# EAGLE board AtariST microATX (EAGLE 7.7.0), part 1 of 3
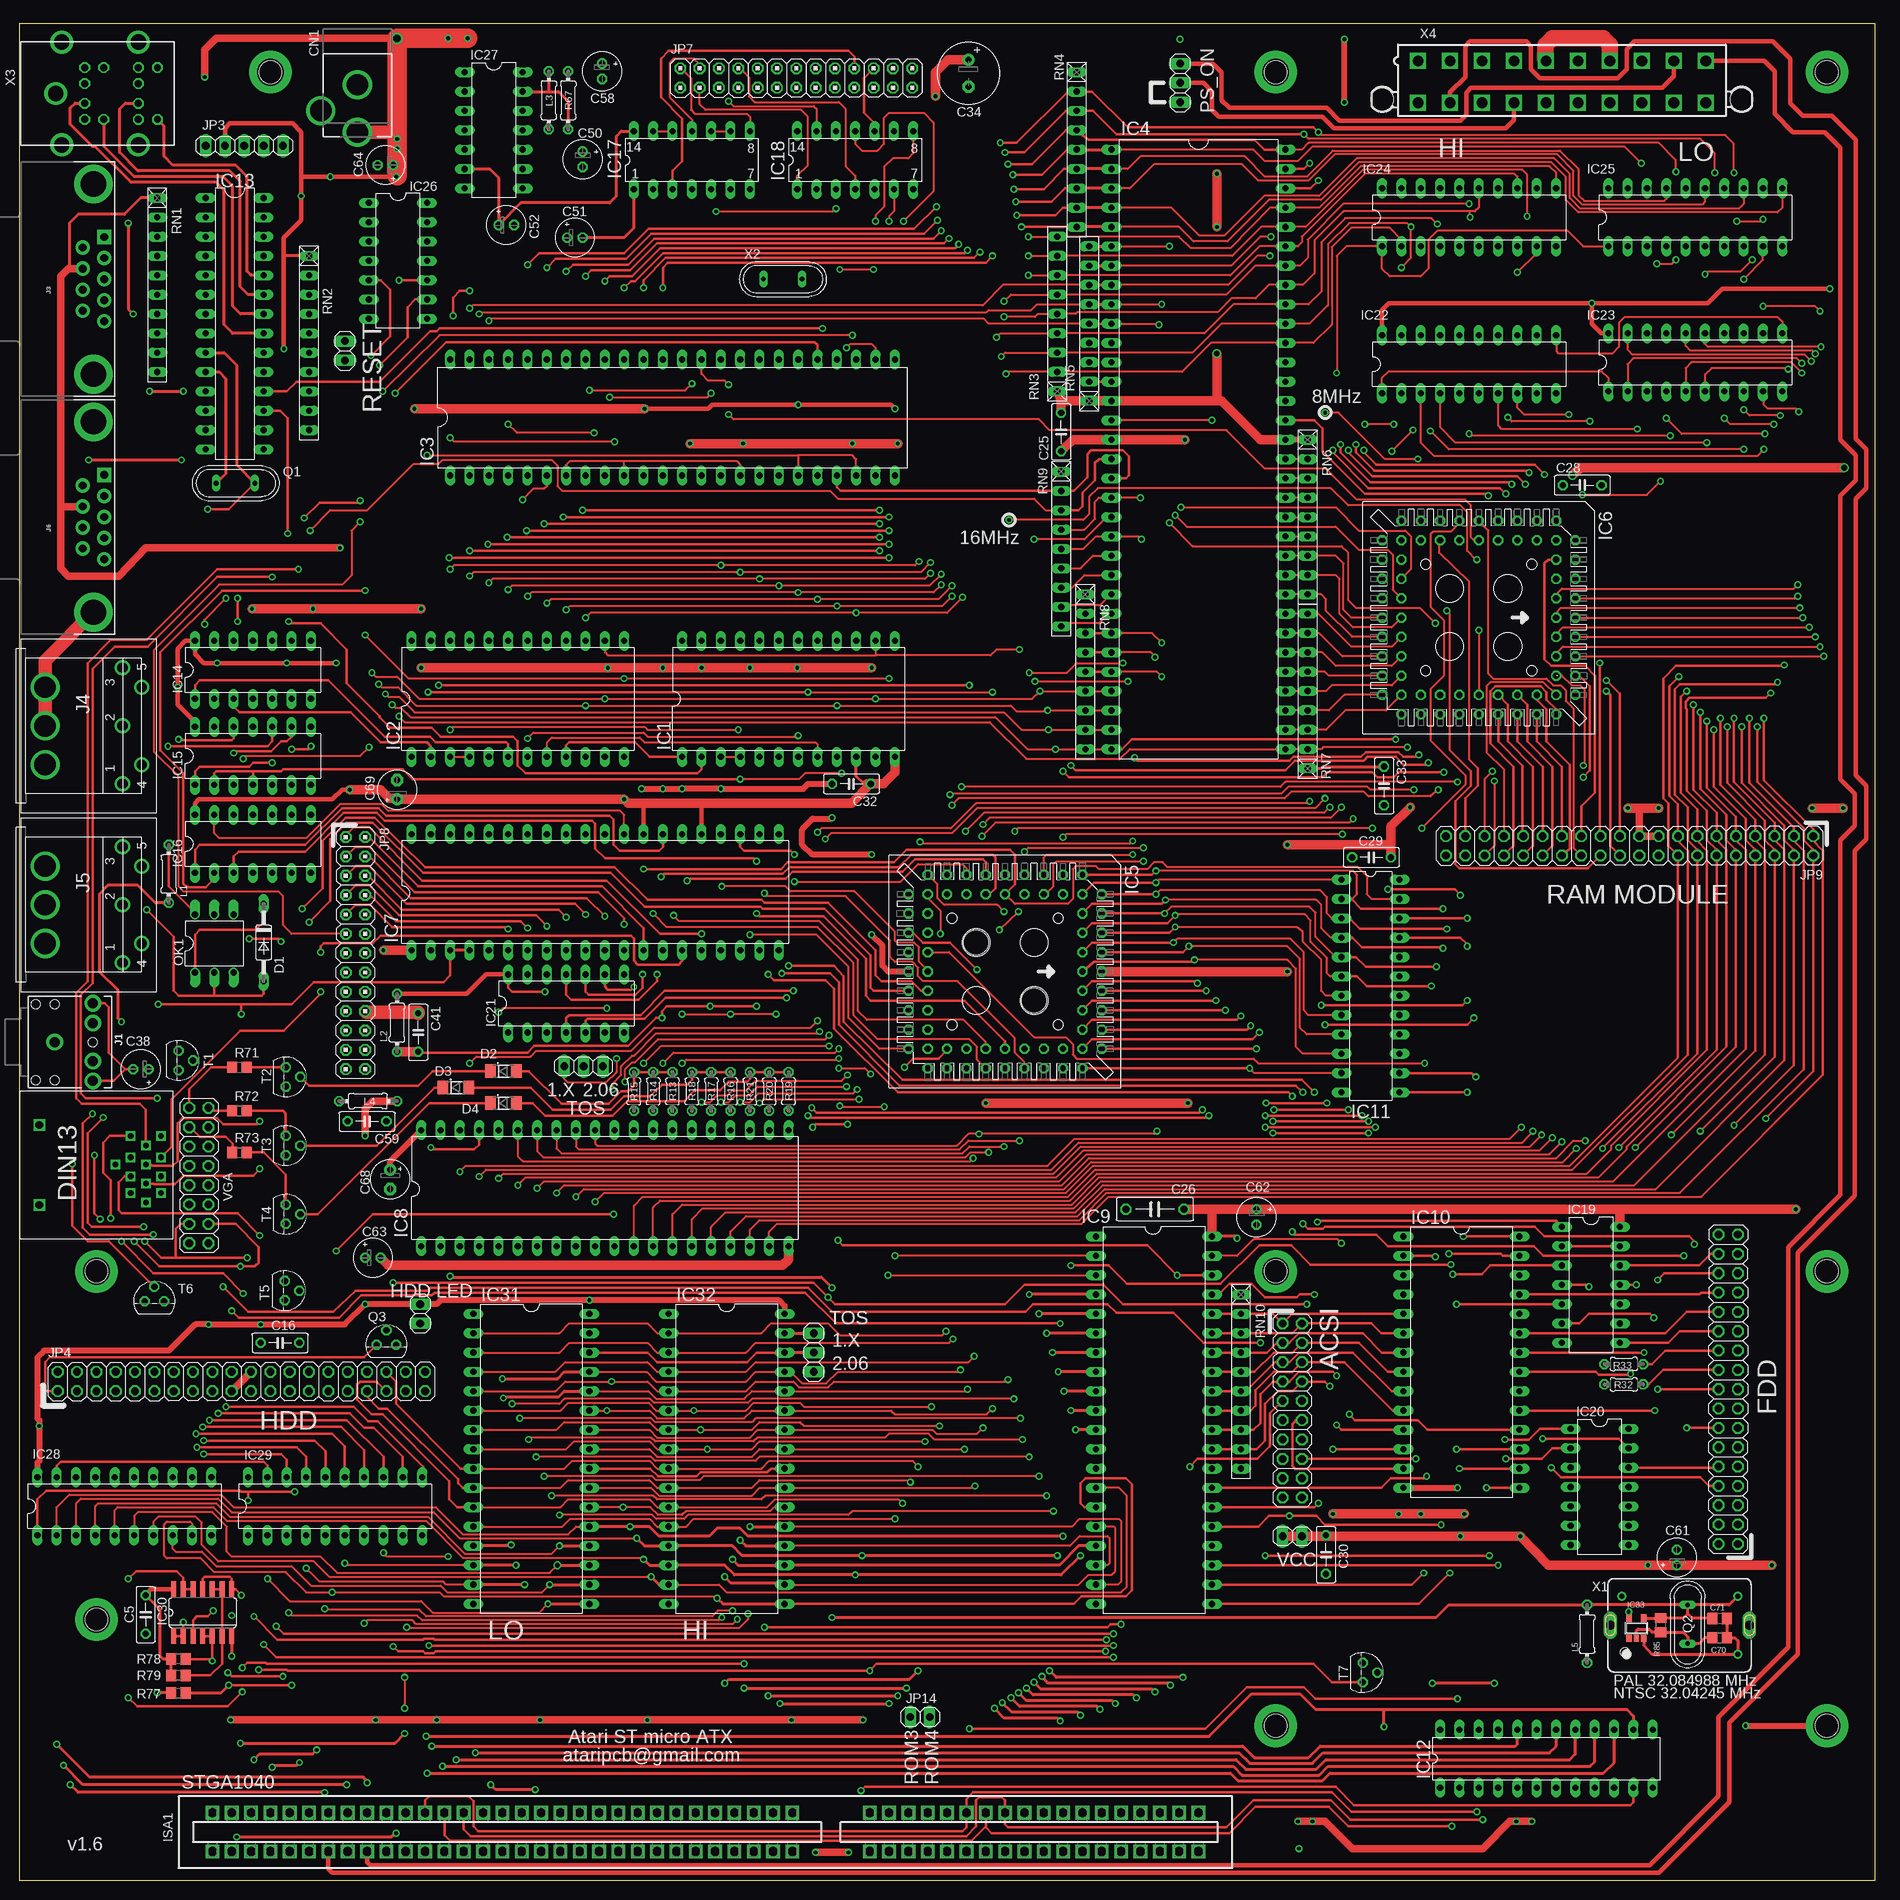
[diagram p5: board, top side]
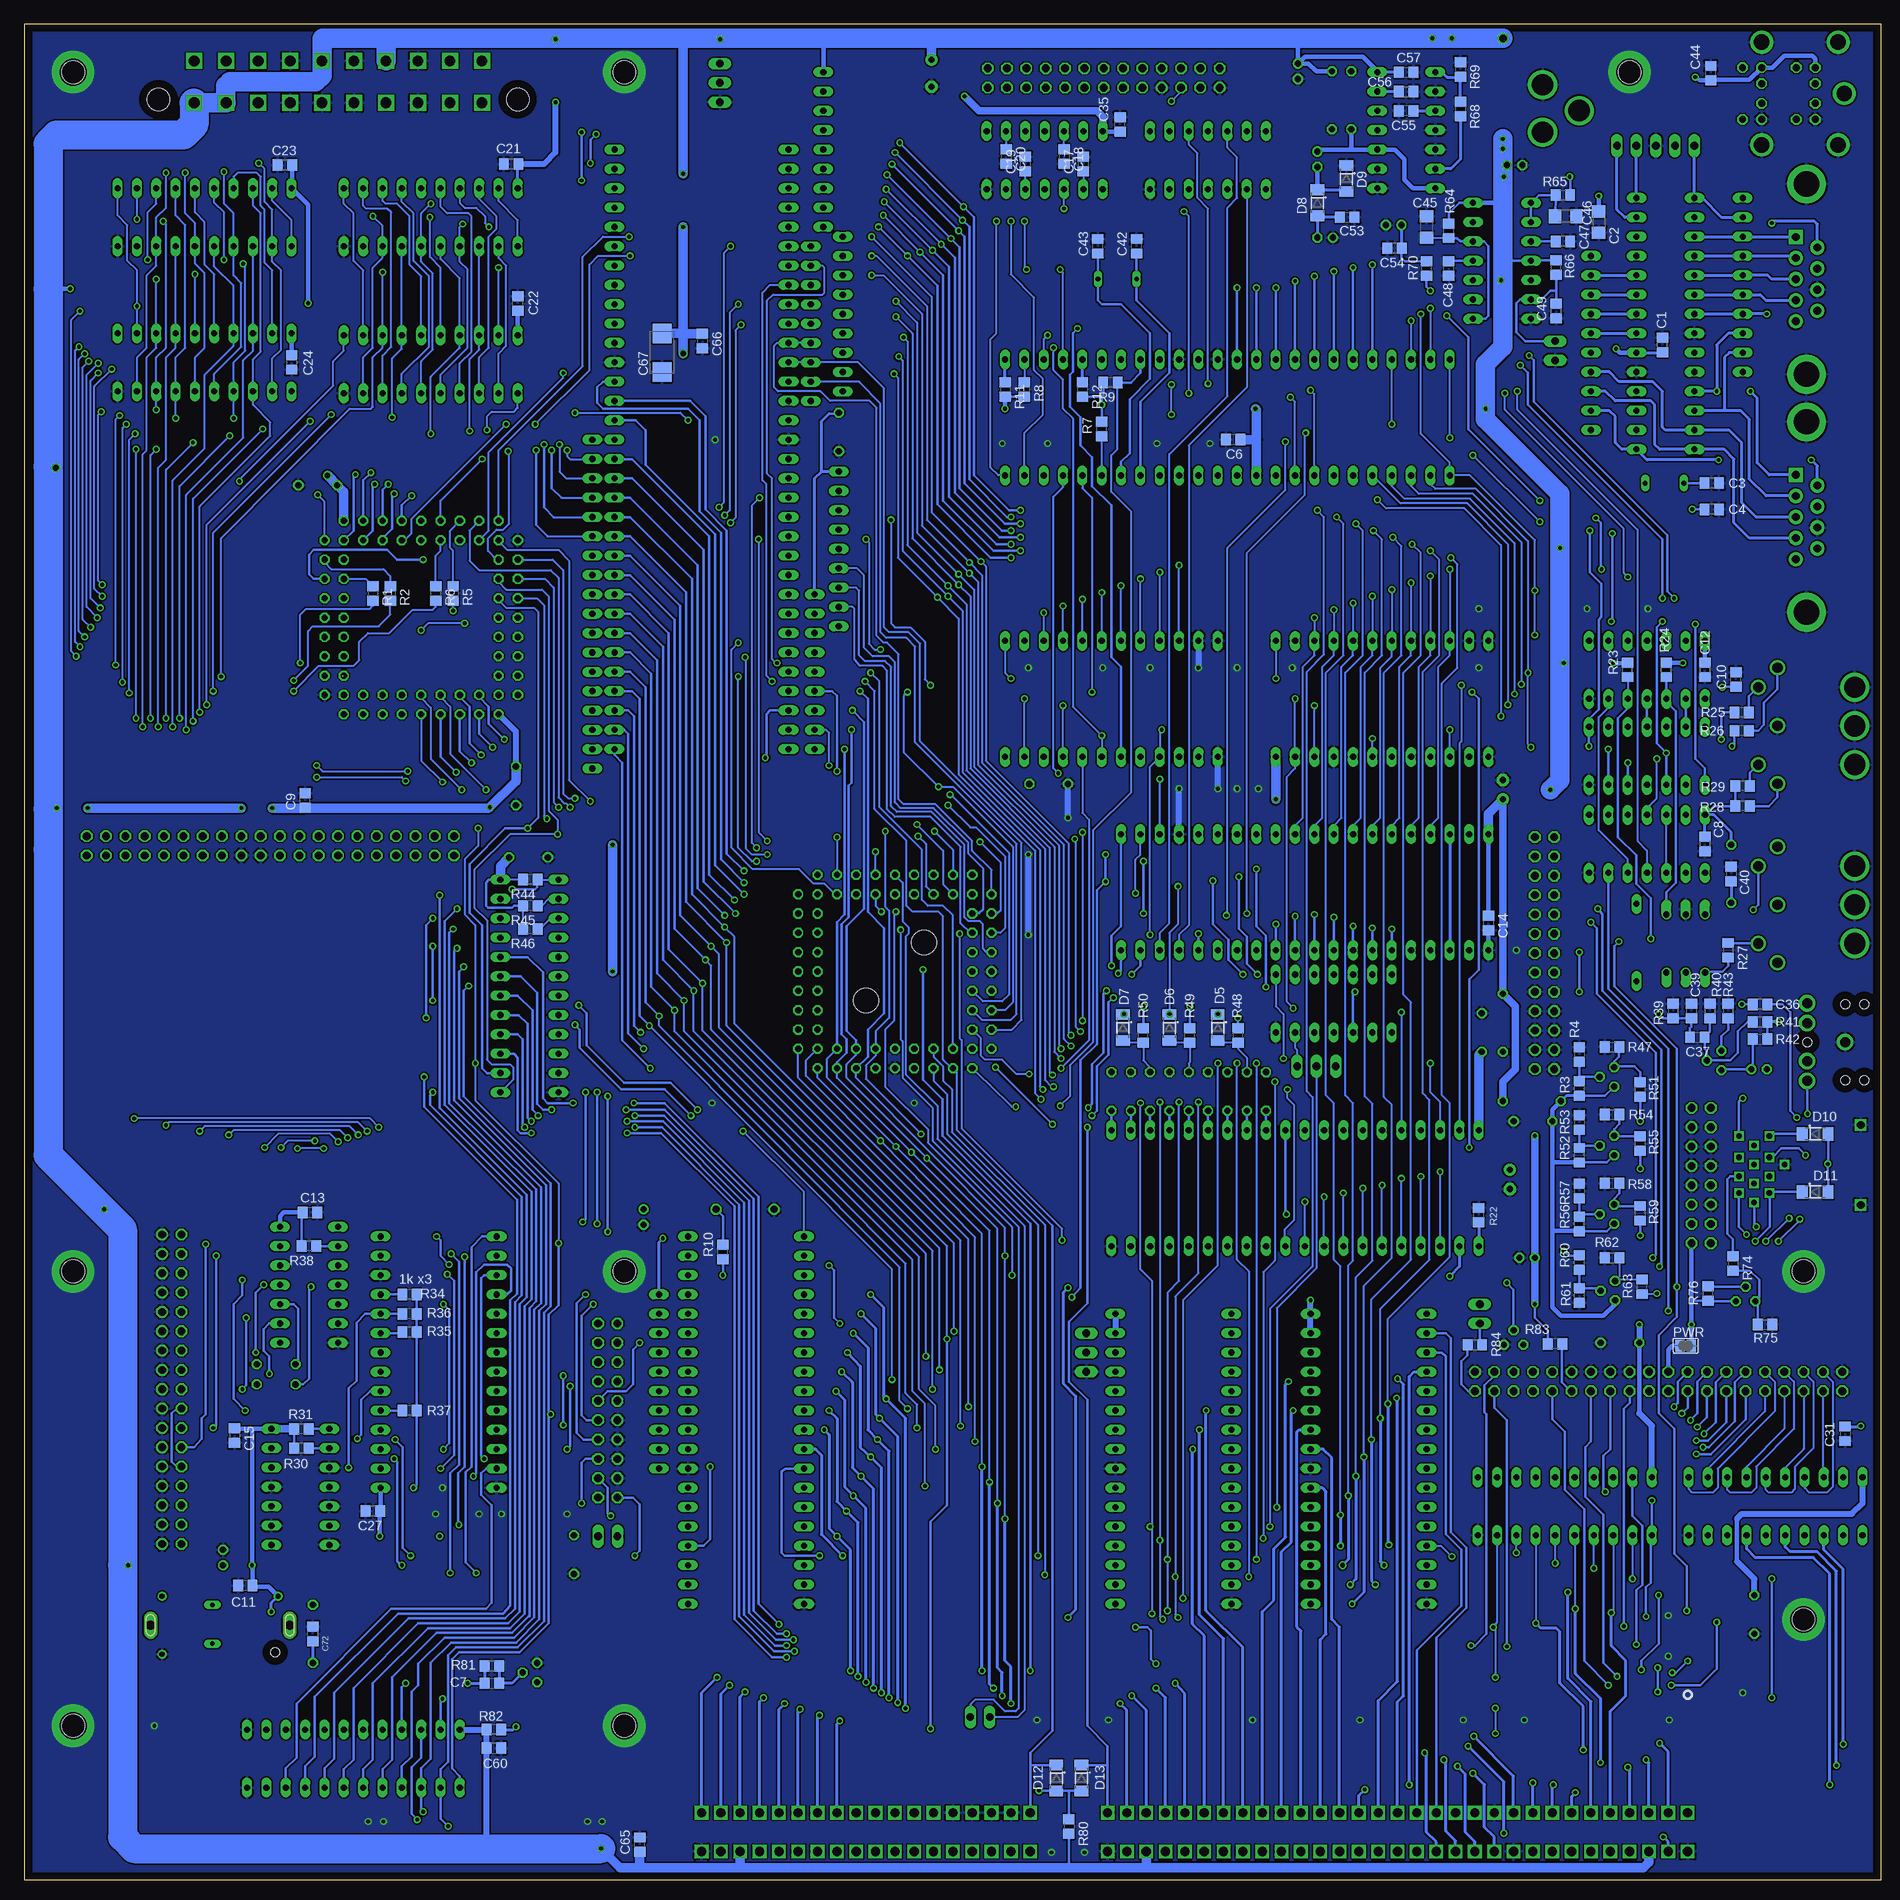
[diagram p6: board, bottom side, seen from below]

Size 243.84 x 243.84 mm. Coordinates in mm from the lower left corner, seen from the top.
Outline: 0,0 243.84,0 243.84,243.84 0,243.84 0,0
Copper layers (1*16): Top 0.035mm / dielectric 1.5mm / Bottom 0.035mm
Design rules "default": minimum track width 10mil, minimum drill 24mil, track to track 8mil, track to pad 8mil, pad to pad 8mil, via to via 8mil, smd to smd 8mil, copper to edge 40mil, drill to drill 8mil, minimum pad ring 10mil, minimum via ring 8mil, stop-mask expansion 4mil, vias tented up to drill 0mil, thermal gap 10mil
Holes 3 mm at 33.02,237.49 165.1,237.49 165.1,80.01 10.16,80.01 10.16,34.29 165.1,20.32 237.49,80.01 237.49,237.49 237.49,20.32
Holes 1.2 mm at 210.95,29.97
Holes 3.3 mm at 125.73,123.19 133.35,115.57

## Footprints (pad centres in the part's own frame; a part is rotated, then mirrored left to right if it is on the bottom)
C0805 = smd 1.3 x 1.5: 1 -0.95,0; 2 0.95,0
C1206 = smd 1.6 x 1.8: 1 -1.4,0; 2 1.4,0
C050-025X075 = drill 0.813 octagon: 1 -2.54,0; 2 2.54,0
C075-032X103 = drill 0.914 octagon: 1 -3.81,0; 2 3.81,0
E3,5-8 = drill 0.813 pad 1.6: + -1.778,0 | drill 0.813 pad 1.6 octagon: - 1.778,0
E2-5 = drill 0.813 pad 1.27: + -1.016,0 | drill 0.813 pad 1.27 octagon: - 1.016,0
C/6032-28R = smd 2.55 x 2.5: + 2.525,0; - -2.525,0
E2,5-5 = drill 0.813 pad 1.6: + -1.27,0 | drill 0.813 pad 1.6 octagon: - 1.27,0
DCJACK_2MM_PTH = drill 2.8: GND 0,7.35; GNDBREAK 4.8,10.75; PWR 0,13.6
DO35-10 = drill 0.813 long: A 5.08,0; C -5.08,0
SOD80_DO213AA_MINIMELF = smd 1.4 x 1.8: A 1.7,0; C -1.7,0
DIL24 = drill 0.813 long: 1 -13.97,-7.62; 2 -11.43,-7.62; 3 -8.89,-7.62; 4 -6.35,-7.62; 5 -3.81,-7.62; 6 -1.27,-7.62; 7 1.27,-7.62; 8 3.81,-7.62; 9 6.35,-7.62; 10 8.89,-7.62; 11 11.43,-7.62; 12 13.97,-7.62; 13 13.97,7.62; 14 11.43,7.62; 15 8.89,7.62; 16 6.35,7.62; 17 3.81,7.62; 18 1.27,7.62; 19 -1.27,7.62; 20 -3.81,7.62; 21 -6.35,7.62; 22 -8.89,7.62; 23 -11.43,7.62; 24 -13.97,7.62
DIL48 = drill 0.813 long: 1 -29.21,-7.62; 2 -26.67,-7.62; 3 -24.13,-7.62; 4 -21.59,-7.62; 5 -19.05,-7.62; 6 -16.51,-7.62; 7 -13.97,-7.62; 8 -11.43,-7.62; 9 -8.89,-7.62; 10 -6.35,-7.62; 11 -3.81,-7.62; 12 -1.27,-7.62; 13 1.27,-7.62; 14 3.81,-7.62; 15 6.35,-7.62; 16 8.89,-7.62; 17 11.43,-7.62; 18 13.97,-7.62; 19 16.51,-7.62; 20 19.05,-7.62; 21 21.59,-7.62; 22 24.13,-7.62; 23 26.67,-7.62; 24 29.21,-7.62; 25 29.21,7.62; 26 26.67,7.62; 27 24.13,7.62; 28 21.59,7.62; 29 19.05,7.62; 30 16.51,7.62; 31 13.97,7.62; 32 11.43,7.62; 33 8.89,7.62; 34 6.35,7.62; 35 3.81,7.62; 36 1.27,7.62; 37 -1.27,7.62; 38 -3.81,7.62; 39 -6.35,7.62; 40 -8.89,7.62; 41 -11.43,7.62; 42 -13.97,7.62; 43 -16.51,7.62; 44 -19.05,7.62; 45 -21.59,7.62; 46 -24.13,7.62; 47 -26.67,7.62; 48 -29.21,7.62
DIL64 = drill 0.813 long: 1 -39.37,-11.43; 2 -36.83,-11.43; 3 -34.29,-11.43; 4 -31.75,-11.43; 5 -29.21,-11.43; 6 -26.67,-11.43; 7 -24.13,-11.43; 8 -21.59,-11.43; 9 -19.05,-11.43; 10 -16.51,-11.43; 11 -13.97,-11.43; 12 -11.43,-11.43; 13 -8.89,-11.43; 14 -6.35,-11.43; 15 -3.81,-11.43; 16 -1.27,-11.43; 17 1.27,-11.43; 18 3.81,-11.43; 19 6.35,-11.43; 20 8.89,-11.43; 21 11.43,-11.43; 22 13.97,-11.43; 23 16.51,-11.43; 24 19.05,-11.43; 25 21.59,-11.43; 26 24.13,-11.43; 27 26.67,-11.43; 28 29.21,-11.43; 29 31.75,-11.43; 30 34.29,-11.43; 31 36.83,-11.43; 32 39.37,-11.43; 33 39.37,11.43; 34 36.83,11.43; 35 34.29,11.43; 36 31.75,11.43; 37 29.21,11.43; 38 26.67,11.43; 39 24.13,11.43; 40 21.59,11.43; 41 19.05,11.43; 42 16.51,11.43; 43 13.97,11.43; 44 11.43,11.43; 45 8.89,11.43; 46 6.35,11.43; 47 3.81,11.43; 48 1.27,11.43; 49 -1.27,11.43; 50 -3.81,11.43; 51 -6.35,11.43; 52 -8.89,11.43; 53 -11.43,11.43; 54 -13.97,11.43; 55 -16.51,11.43; 56 -19.05,11.43; 57 -21.59,11.43; 58 -24.13,11.43; 59 -26.67,11.43; 60 -29.21,11.43; 61 -31.75,11.43; 62 -34.29,11.43; 63 -36.83,11.43; 64 -39.37,11.43
PLCC68 = drill 0.813 octagon: 1 0,12.7; 2 0,10.16; 3 -2.54,12.7; 4 -2.54,10.16; 5 -5.08,12.7; 6 -5.08,10.16; 7 -7.62,12.7; 8 -7.62,10.16; 9 -10.16,12.7; 10 -12.7,10.16; 11 -10.16,10.16; 12 -12.7,7.62; 13 -10.16,7.62; 14 -12.7,5.08; 15 -10.16,5.08; 16 -12.7,2.54; 17 -10.16,2.54; 18 -12.7,0; 19 -10.16,0; 20 -12.7,-2.54; 21 -10.16,-2.54; 22 -12.7,-5.08; 23 -10.16,-5.08; 24 -12.7,-7.62; 25 -10.16,-7.62; 26 -12.7,-10.16; 27 -10.16,-12.7; 28 -10.16,-10.16; 29 -7.62,-12.7; 30 -7.62,-10.16; 31 -5.08,-12.7; 32 -5.08,-10.16; 33 -2.54,-12.7; 34 -2.54,-10.16; 35 0,-12.7; 36 0,-10.16; 37 2.54,-12.7; 38 2.54,-10.16; 39 5.08,-12.7; 40 5.08,-10.16; 41 7.62,-12.7; 42 7.62,-10.16; 43 10.16,-12.7; 44 12.7,-10.16; 45 10.16,-10.16; 46 12.7,-7.62; 47 10.16,-7.62; 48 12.7,-5.08; 49 10.16,-5.08; 50 12.7,-2.54; 51 10.16,-2.54; 52 12.7,0; 53 10.16,0; 54 12.7,2.54; 55 10.16,2.54; 56 12.7,5.08; 57 10.16,5.08; 58 12.7,7.62; 59 10.16,7.62; 60 12.7,10.16; 61 10.16,12.7; 62 10.16,10.16; 63 7.62,12.7; 64 7.62,10.16; 65 5.08,12.7; 66 5.08,10.16; 67 2.54,12.7; 68 2.54,10.16
DIL40 = drill 0.813 long: 1 -24.13,-7.62; 2 -21.59,-7.62; 3 -19.05,-7.62; 4 -16.51,-7.62; 5 -13.97,-7.62; 6 -11.43,-7.62; 7 -8.89,-7.62; 8 -6.35,-7.62; 9 -3.81,-7.62; 10 -1.27,-7.62; 11 1.27,-7.62; 12 3.81,-7.62; 13 6.35,-7.62; 14 8.89,-7.62; 15 11.43,-7.62; 16 13.97,-7.62; 17 16.51,-7.62; 18 19.05,-7.62; 19 21.59,-7.62; 20 24.13,-7.62; 21 24.13,7.62; 22 21.59,7.62; 23 19.05,7.62; 24 16.51,7.62; 25 13.97,7.62; 26 11.43,7.62; 27 8.89,7.62; 28 6.35,7.62; 29 3.81,7.62; 30 1.27,7.62; 31 -1.27,7.62; 32 -3.81,7.62; 33 -6.35,7.62; 34 -8.89,7.62; 35 -11.43,7.62; 36 -13.97,7.62; 37 -16.51,7.62; 38 -19.05,7.62; 39 -21.59,7.62; 40 -24.13,7.62
DIL28 = drill 0.813 long: 1 -16.51,-7.62; 2 -13.97,-7.62; 3 -11.43,-7.62; 4 -8.89,-7.62; 5 -6.35,-7.62; 6 -3.81,-7.62; 7 -1.27,-7.62; 8 1.27,-7.62; 9 3.81,-7.62; 10 6.35,-7.62; 11 8.89,-7.62; 12 11.43,-7.62; 13 13.97,-7.62; 14 16.51,-7.62; 15 16.51,7.62; 16 13.97,7.62; 17 11.43,7.62; 18 8.89,7.62; 19 6.35,7.62; 20 3.81,7.62; 21 1.27,7.62; 22 -1.27,7.62; 23 -3.81,7.62; 24 -6.35,7.62; 25 -8.89,7.62; 26 -11.43,7.62; 27 -13.97,7.62; 28 -16.51,7.62
DIL24-3 = drill 0.813 long: 1 -13.97,-3.81; 2 -11.43,-3.81; 3 -8.89,-3.81; 4 -6.35,-3.81; 5 -3.81,-3.81; 6 -1.27,-3.81; 7 1.27,-3.81; 8 3.81,-3.81; 9 6.35,-3.81; 10 8.89,-3.81; 11 11.43,-3.81; 12 13.97,-3.81; 13 13.97,3.81; 14 11.43,3.81; 15 8.89,3.81; 16 6.35,3.81; 17 3.81,3.81; 18 1.27,3.81; 19 -1.27,3.81; 20 -3.81,3.81; 21 -6.35,3.81; 22 -8.89,3.81; 23 -11.43,3.81; 24 -13.97,3.81
DIL28-3 = drill 0.813 long: 1 -16.51,-3.81; 2 -13.97,-3.81; 3 -11.43,-3.81; 4 -8.89,-3.81; 5 -6.35,-3.81; 6 -3.81,-3.81; 7 -1.27,-3.81; 8 1.27,-3.81; 9 3.81,-3.81; 10 6.35,-3.81; 11 8.89,-3.81; 12 11.43,-3.81; 13 13.97,-3.81; 14 16.51,-3.81; 15 16.51,3.81; 16 13.97,3.81; 17 11.43,3.81; 18 8.89,3.81; 19 6.35,3.81; 20 3.81,3.81; 21 1.27,3.81; 22 -1.27,3.81; 23 -3.81,3.81; 24 -6.35,3.81; 25 -8.89,3.81; 26 -11.43,3.81; 27 -13.97,3.81; 28 -16.51,3.81
DIL14 = drill 0.813 long: 1 -7.62,-3.81; 2 -5.08,-3.81; 3 -2.54,-3.81; 4 0,-3.81; 5 2.54,-3.81; 6 5.08,-3.81; 7 7.62,-3.81; 8 7.62,3.81; 9 5.08,3.81; 10 2.54,3.81; 11 0,3.81; 12 -2.54,3.81; 13 -5.08,3.81; 14 -7.62,3.81
DIL14' = drill 0.8 long: 1 -7.62,-3.81; 2 -5.08,-3.81; 3 -2.54,-3.81; 4 0,-3.81; 5 2.54,-3.81; 6 5.08,-3.81; 7 7.62,-3.81; 8 7.62,3.81; 9 5.08,3.81; 10 2.54,3.81; 11 0,3.81; 12 -2.54,3.81; 13 -5.08,3.81; 14 -7.62,3.81
DIL20 = drill 0.813 long: 1 -11.43,-3.81; 2 -8.89,-3.81; 3 -6.35,-3.81; 4 -3.81,-3.81; 5 -1.27,-3.81; 6 1.27,-3.81; 7 3.81,-3.81; 8 6.35,-3.81; 9 8.89,-3.81; 10 11.43,-3.81; 11 11.43,3.81; 12 8.89,3.81; 13 6.35,3.81; 14 3.81,3.81; 15 1.27,3.81; 16 -1.27,3.81; 17 -3.81,3.81; 18 -6.35,3.81; 19 -8.89,3.81; 20 -11.43,3.81
SO14 = smd 0.66 x 2.032: 1 -3.81,-3.073; 2 -2.54,-3.073; 3 -1.27,-3.073; 4 0,-3.073; 5 1.27,-3.073; 6 2.54,-3.073; 7 3.81,-3.073; 8 3.81,3.073; 9 2.54,3.073; 10 1.27,3.073; 11 0,3.073; 12 -1.27,3.073; 13 -2.54,3.073; 14 -3.81,3.073
DIL32 = drill 0.813 long: 1 -19.05,-7.62; 2 -16.51,-7.62; 3 -13.97,-7.62; 4 -11.43,-7.62; 5 -8.89,-7.62; 6 -6.35,-7.62; 7 -3.81,-7.62; 8 -1.27,-7.62; 9 1.27,-7.62; 10 3.81,-7.62; 11 6.35,-7.62; 12 8.89,-7.62; 13 11.43,-7.62; 14 13.97,-7.62; 15 16.51,-7.62; 16 19.05,-7.62; 17 19.05,7.62; 18 16.51,7.62; 19 13.97,7.62; 20 11.43,7.62; 21 8.89,7.62; 22 6.35,7.62; 23 3.81,7.62; 24 1.27,7.62; 25 -1.27,7.62; 26 -3.81,7.62; 27 -6.35,7.62; 28 -8.89,7.62; 29 -11.43,7.62; 30 -13.97,7.62; 31 -16.51,7.62; 32 -19.05,7.62
SOT23-5 = smd 0.69 x 0.99: 1 -0.95,-1.29; 2 0,-1.29; 3 0.95,-1.29; 4 0.95,1.3; 5 -0.95,1.3
ISA-16 = drill 1.2 pad 1.778 square: A1 81.28,-2.54; A2 78.74,-2.54; A3 76.2,-2.54; A4 73.66,-2.54; A5 71.12,-2.54; A6 68.58,-2.54; A7 66.04,-2.54; A8 63.5,-2.54; A9 60.96,-2.54; A10 58.42,-2.54; A11 55.88,-2.54; A12 53.34,-2.54; A13 50.8,-2.54; A14 48.26,-2.54; A15 45.72,-2.54; A16 43.18,-2.54; A17 40.64,-2.54; A18 38.1,-2.54; A19 35.56,-2.54; A20 33.02,-2.54; A21 30.48,-2.54; A22 27.94,-2.54; A23 25.4,-2.54; A24 22.86,-2.54; A25 20.32,-2.54; A26 17.78,-2.54; A27 15.24,-2.54; A28 12.7,-2.54; A29 10.16,-2.54; A30 7.62,-2.54; A31 5.08,-2.54; B1 81.28,2.54; B2 78.74,2.54; B3 76.2,2.54; B4 73.66,2.54; B5 71.12,2.54; B6 68.58,2.54; B7 66.04,2.54; B8 63.5,2.54; B9 60.96,2.54; B10 58.42,2.54; B11 55.88,2.54; B12 53.34,2.54; B13 50.8,2.54; B14 48.26,2.54; B15 45.72,2.54; B16 43.18,2.54; B17 40.64,2.54; B18 38.1,2.54; B19 35.56,2.54; B20 33.02,2.54; B21 30.48,2.54; B22 27.94,2.54; B23 25.4,2.54; B24 22.86,2.54; B25 20.32,2.54; B26 17.78,2.54; B27 15.24,2.54; B28 12.7,2.54; B29 10.16,2.54; B30 7.62,2.54; B31 5.08,2.54; C1 -5.08,-2.54; C2 -7.62,-2.54; C3 -10.16,-2.54; C4 -12.7,-2.54; C5 -15.24,-2.54; C6 -17.78,-2.54; C7 -20.32,-2.54; C8 -22.86,-2.54; C9 -25.4,-2.54; C10 -27.94,-2.54; C11 -30.48,-2.54; C12 -33.02,-2.54; C13 -35.56,-2.54; C14 -38.1,-2.54; C15 -40.64,-2.54; C16 -43.18,-2.54; C17 -45.72,-2.54; C18 -48.26,-2.54; D1 -5.08,2.54; D2 -7.62,2.54; D3 -10.16,2.54; D4 -12.7,2.54; D5 -15.24,2.54; D6 -17.78,2.54; D7 -20.32,2.54; D8 -22.86,2.54; D9 -25.4,2.54; D10 -27.94,2.54; D11 -30.48,2.54; D12 -33.02,2.54; D13 -35.56,2.54; D14 -38.1,2.54; D15 -40.64,2.54; D16 -43.18,2.54; D17 -45.72,2.54; D18 -48.26,2.54
AUDIO-JACK-KIT = drill 1.3 pad 2.184: RING 5,5.1; RSH 5,2.5; SLEEVE 0,0; TIP 5,-5.1; TSH 5,-2.5 | hole 1.2: 0,5; -2.5,5; -2.5,-5; 0,-5; 5,0
DB9_MALE = drill 1.016 pad 1.88 square: 1 5.54,-1.42 | drill 1.016 pad 1.88: 2 2.77,-1.42; 3 0,-1.42; 4 -2.77,-1.42; 5 -5.54,-1.42; 6 4.15,1.42; 7 1.38,1.42; 8 -1.38,1.42; 9 -4.15,1.42 | drill 3.302 pad 5.08: G1 -12.5,0; G2 12.5,0
DIN5 = drill 1.321: 1 -7.62,-6.35; 2 0,-6.35; 3 7.62,-6.35; 4 -5.08,-8.89; 5 5.08,-8.89 | drill 2.8: SHIELD1 5.08,3.81; SHIELD2 0,3.81; SHIELD3 -5.08,3.81
1X02 = drill 1.016 long: 1 -1.27,0; 2 1.27,0
1X05 = drill 1.016 long: 1 -5.08,0; 2 -2.54,0; 3 0,0; 4 2.54,0; 5 5.08,0
2X20 = drill 1.016 octagon: 1 -24.13,-1.27; 2 -24.13,1.27; 3 -21.59,-1.27; 4 -21.59,1.27; 5 -19.05,-1.27; 6 -19.05,1.27; 7 -16.51,-1.27; 8 -16.51,1.27; 9 -13.97,-1.27; 10 -13.97,1.27; 11 -11.43,-1.27; 12 -11.43,1.27; 13 -8.89,-1.27; 14 -8.89,1.27; 15 -6.35,-1.27; 16 -6.35,1.27; 17 -3.81,-1.27; 18 -3.81,1.27; 19 -1.27,-1.27; 20 -1.27,1.27; 21 1.27,-1.27; 22 1.27,1.27; 23 3.81,-1.27; 24 3.81,1.27; 25 6.35,-1.27; 26 6.35,1.27; 27 8.89,-1.27; 28 8.89,1.27; 29 11.43,-1.27; 30 11.43,1.27; 31 13.97,-1.27; 32 13.97,1.27; 33 16.51,-1.27; 34 16.51,1.27; 35 19.05,-1.27; 36 19.05,1.27; 37 21.59,-1.27; 38 21.59,1.27; 39 24.13,-1.27; 40 24.13,1.27
2X17 = drill 1.016 octagon: 1 -20.32,-1.27; 2 -20.32,1.27; 3 -17.78,-1.27; 4 -17.78,1.27; 5 -15.24,-1.27; 6 -15.24,1.27; 7 -12.7,-1.27; 8 -12.7,1.27; 9 -10.16,-1.27; 10 -10.16,1.27; 11 -7.62,-1.27; 12 -7.62,1.27; 13 -5.08,-1.27; 14 -5.08,1.27; 15 -2.54,-1.27; 16 -2.54,1.27; 17 0,-1.27; 18 0,1.27; 19 2.54,-1.27; 20 2.54,1.27; 21 5.08,-1.27; 22 5.08,1.27; 23 7.62,-1.27; 24 7.62,1.27; 25 10.16,-1.27; 26 10.16,1.27; 27 12.7,-1.27; 28 12.7,1.27; 29 15.24,-1.27; 30 15.24,1.27; 31 17.78,-1.27; 32 17.78,1.27; 33 20.32,-1.27; 34 20.32,1.27
2X10 = drill 1.016 octagon: 1 -11.43,-1.27; 2 -11.43,1.27; 3 -8.89,-1.27; 4 -8.89,1.27; 5 -6.35,-1.27; 6 -6.35,1.27; 7 -3.81,-1.27; 8 -3.81,1.27; 9 -1.27,-1.27; 10 -1.27,1.27; 11 1.27,-1.27; 12 1.27,1.27; 13 3.81,-1.27; 14 3.81,1.27; 15 6.35,-1.27; 16 6.35,1.27; 17 8.89,-1.27; 18 8.89,1.27; 19 11.43,-1.27; 20 11.43,1.27
2X13 = drill 1.016 octagon: 1 -15.24,-1.27; 2 -15.24,1.27; 3 -12.7,-1.27; 4 -12.7,1.27; 5 -10.16,-1.27; 6 -10.16,1.27; 7 -7.62,-1.27; 8 -7.62,1.27; 9 -5.08,-1.27; 10 -5.08,1.27; 11 -2.54,-1.27; 12 -2.54,1.27; 13 0,-1.27; 14 0,1.27; 15 2.54,-1.27; 16 2.54,1.27; 17 5.08,-1.27; 18 5.08,1.27; 19 7.62,-1.27; 20 7.62,1.27; 21 10.16,-1.27; 22 10.16,1.27; 23 12.7,-1.27; 24 12.7,1.27; 25 15.24,-1.27; 26 15.24,1.27
1X03 = drill 1.016 long: 1 -2.54,0; 2 0,0; 3 2.54,0
0204/7 = drill 0.813 octagon: 1 -3.81,0; 2 3.81,0
DIL06 = drill 0.813 offset: 1 -2.54,-3.81; 2 0,-3.81; 3 2.54,-3.81; 4 2.54,3.81; 5 0,3.81; 6 -2.54,3.81
SJ = smd 1.168 x 1.6: 1 -0.762,0; 2 0.762,0
QS = drill 0.61 long: 1 -2.54,0; 2 2.54,0
TO92 = drill 0.813 octagon: 1 1.27,0; 2 0,1.905; 3 -1.27,0
R0805 = smd 1.3 x 1.5: 1 -0.95,0; 2 0.95,0
0204/5 = drill 0.813 octagon: 1 -2.54,0; 2 2.54,0
RN-10 = drill 0.813 long: 1 -11.43,0; 2 -8.89,0; 3 -6.35,0; 4 -3.81,0; 5 -1.27,0; 6 1.27,0; 7 3.81,0; 8 6.35,0; 9 8.89,0; 10 11.43,0
RN-9 = drill 0.813 long: 1 -10.16,0; 2 -7.62,0; 3 -5.08,0; 4 -2.54,0; 5 0,0; 6 2.54,0; 7 5.08,0; 8 7.62,0; 9 10.16,0
DIN-13 = drill 1 square: M1 -5.25,7.5; M2 5.25,7.5 | drill 0.75 square: PIN1 -3.7,-8.5; PIN2 -1.5,-8.5; PIN3 1,-8.5; PIN4 3.8,-8.5; PIN5 -4.95,-6.5; PIN6 -2.45,-6.5; PIN7 0.05,-6.5; PIN8 2.55,-6.5; PIN9 -3.7,-4.5; PIN10 -1.5,-4.5; PIN11 1,-4.5; PIN12 3.8,-4.5; PIN13 0.05,-2.5
2X08 = drill 1.016 octagon: 1 -8.89,-1.27; 2 -8.89,1.27; 3 -6.35,-1.27; 4 -6.35,1.27; 5 -3.81,-1.27; 6 -3.81,1.27; 7 -1.27,-1.27; 8 -1.27,1.27; 9 1.27,-1.27; 10 1.27,1.27; 11 3.81,-1.27; 12 3.81,1.27; 13 6.35,-1.27; 14 6.35,1.27; 15 8.89,-1.27; 16 8.89,1.27
TC46 = drill 0.7 pad 1.016: 7 7.62,-3.81; 8 7.62,3.81; 14 -7.62,3.81 | drill 1.2 pad 1.6 long: S@1 -9.144,0 | drill 1.2 pad 1.5 long: S@2 9.144,0
SSV-BD06 = drill 0.9 octagon: 1-1 1.3,8.5; 1-2 -1.3,8.5; 1-3 3.4,8.5; 1-4 -3.4,8.5; 1-5 3.4,11; 1-6 -3.4,11; 2-1 1.3,15.55; 2-2 -1.3,15.55; 2-3 3.4,15.55; 2-4 -3.4,15.55; 2-5 3.4,18.05; 2-6 -3.4,18.05 | drill 2: G1 -6.75,15.55; G2 6.75,15.55; G3 -6.75,5.5; G4 6.75,5.5; GND 0,4.7
5566-20 = drill 1.4 square: 1 18.9,-2.75; 2 14.7,-2.75; 3 10.5,-2.75; 4 6.3,-2.75; 5 2.1,-2.75; 6 -2.1,-2.75; 7 -6.3,-2.75; 8 -10.5,-2.75; 9 -14.7,-2.75; 10 -18.9,-2.75; 11 18.9,2.75; 12 14.7,2.75; 13 10.5,2.75; 14 6.3,2.75; 15 2.1,2.75; 16 -2.1,2.75; 17 -6.3,2.75; 18 -10.5,2.75; 19 -14.7,2.75; 20 -18.9,2.75 | hole 3: 23.6,2.29; -23.6,2.29

## Placement (x,y rotation side)
C1  100n  [C0805]  28.7,201.68 90 bottom
C2  10u  [C1206]  37.08,217.81 270 bottom
C3  22p  [C0805]  22.23,183.51 180 bottom
C4  22p  [C0805]  22.23,180.09 180 bottom
C5  [C050-025X075]  16.64,34.92 270 top
C6  [C0805]  85.09,189.23 180 bottom
C7  100p  [C0805]  182.5,25.91 0 bottom
C8  [C0805]  23.11,136.14 270 bottom
C9  [C0805]  207.01,141.86 90 bottom
C10  [C0805]  19.05,157.73 90 bottom
C11  [C0805]  214.88,38.73 180 bottom
C12  [C0805]  23.11,159 270 bottom
C13  [C0805]  206.38,87.76 0 bottom
C14  [C0805]  51.56,125.73 270 bottom
C15  [C0805]  216.28,58.42 270 bottom
C16  [C050-025X075]  34.29,70.61 0 top
C17  100p  [C0805]  104.78,225.43 90 bottom
C18  100p  [C0805]  107.31,226.44 270 bottom
C19  100p  [C0805]  112.39,225.43 90 bottom
C20  100p  [C0805]  114.94,226.44 270 bottom
C21  [C0805]  179.96,225.43 180 bottom
C22  [C0805]  179.07,207.14 90 bottom
C23  [C0805]  209.68,225.3 180 bottom
C24  [C0805]  208.79,199.39 270 bottom
C25  [C050-025X075]  136.91,190.25 270 top
C26  [C075-032X103]  149.22,88.14 180 top
C27  [C0805]  198.12,48.51 180 bottom
C28  [C050-025X075]  205.36,183.26 0 top
C29  [C050-025X075]  177.67,134.37 180 top
C30  [C050-025X075]  171.7,42.8 270 top
C31  [C0805]  4.7,58.67 270 bottom
C32  [C050-025X075]  109.35,144.02 180 top
C33  [C050-025X075]  179.32,143.76 270 top
C34  470u  [E3,5-8]  124.71,237.36 270 top
C35  [C0805]  99.95,230.63 90 bottom
C36  1u  [C0805]  15.88,115.06 180 bottom
C37  1u  [C0805]  24.13,110.74 0 bottom
C38  47u  [E2-5]  16,106.55 180 top
C39  100n  [C0805]  24.89,114.17 270 bottom
C40  100n  [C0805]  19.68,132.21 270 bottom
C41  100n  [C050-025X075]  52.45,111.38 270 top
C42  30p  [C0805]  97.79,214.63 90 bottom
C43  30p  [C0805]  102.87,214.63 90 bottom
C44  [C0805]  22.35,237.36 90 bottom
C45  22u  [C1206]  59.69,217.17 270 bottom
C46  22u  [C1206]  41.4,218.57 180 bottom
C47  10n  [C0805]  41.78,215.26 180 bottom
C48  10n  [C0805]  56.77,211.71 90 bottom
C49  100n  [C0805]  42.67,206.12 90 bottom
C50  4u7  [E2-5]  74.04,226.06 270 top
C51  4u7  [E2-5]  73.03,215.77 0 top
C52  4u7  [E2-5]  64.01,217.42 0 top
C53  100n  [C0805]  70.1,218.44 0 bottom
C54  100n  [C0805]  63.88,214.38 180 bottom
C55  330p  [C0805]  62.36,232.41 180 bottom
C56  150p  [C0805]  62.36,234.95 0 bottom
C57  100n  [C0805]  62.36,237.49 0 bottom
C58  10u  [E2-5]  76.58,237.62 270 top
C59  [C050-025X075]  45.72,99.69 0 top
C60  [C0805]  182.25,17.4 0 bottom
C61  47u  [E2-5]  217.81,42.42 90 top
C62  47  [E2-5]  162.56,87.12 270 top
C63  47u  [E2-5]  46.48,81.79 0 top
C64  47u  [E2-5]  48.13,225.3 180 top
C65  10u  [C0805]  163.07,4.7 90 bottom
C66  [C0805]  154.81,202.18 270 bottom
C67  [C/6032-28R]  160.15,200.66 90 bottom
C68  47u  [E2,5-5]  48.77,92.08 270 top
C69  47u  [E2,5-5]  49.66,143.26 90 top
C70  15p  [C0805]  223.39,31.88 0 top
C71  15p  [C0805]  223.39,34.42 0 top
C72  opt  [C0805]  205.99,32.38 90 bottom
CN1  [DCJACK_2MM_PTH]  44.45,243.21 180 top
D1  1N914  [DO35-10]  32.13,123.19 270 top
D2  LL4148  [SOD80_DO213AA_MINIMELF]  63.63,106.3 0 top
D3  LL4148  [SOD80_DO213AA_MINIMELF]  57.4,104.14 0 top
D4  LL4148  [SOD80_DO213AA_MINIMELF]  63.63,102.11 0 top
D5  LL4148  [SOD80_DO213AA_MINIMELF]  87.12,112.01 270 bottom
D6  LL4148  [SOD80_DO213AA_MINIMELF]  93.47,112.01 270 bottom
D7  LL4148  [SOD80_DO213AA_MINIMELF]  99.57,112.01 270 bottom
D8  LL4148  [SOD80_DO213AA_MINIMELF]  74.04,220.34 270 bottom
D9  LL4148  [SOD80_DO213AA_MINIMELF]  70.23,223.52 270 bottom
D10  LL4148  [SOD80_DO213AA_MINIMELF]  8.64,98.04 0 bottom
D11  LL4148  [SOD80_DO213AA_MINIMELF]  8.64,90.42 0 bottom
D12  LL4148  [SOD80_DO213AA_MINIMELF]  108.33,13.46 270 bottom
D13  LL4148  [SOD80_DO213AA_MINIMELF]  105.03,13.46 270 bottom
IC1  6850  [DIL24]  101.09,155.19 0 top
IC2  6850  [DIL24]  65.53,155.19 0 top
IC3  MC68901P  [DIL48]  85.85,192.15 0 top
IC4  MC68000  [DIL64]  154.94,187.96 270 top
IC5  GLUE  [PLCC68]  129.54,119.38 270 top
IC6  MMU  [PLCC68]  191.77,165.86 270 top
IC7  YM2149  [DIL40]  75.69,129.79 0 top
IC8  SHIFTER  [DIL40]  76.96,90.93 0 top
IC9  DMA  [DIL40]  149.1,60.45 270 top
IC10  WD1772  [DIL28]  189.48,68.07 270 top
IC11  [DIL24-3]  177.55,117.47 270 top
IC12  [DIL24-3]  200.66,16 0 top
IC13  PIC16F876  [DIL28-3]  28.32,204.47 270 top
IC14  74LS04N  [DIL14]  30.73,159 0 top
IC15  74LS05N  [DIL14]  30.73,147.7 0 top
IC16  74LS02N  [DIL14]  30.73,136.14 0 top
IC17  1488N  [DIL14']  88.39,225.93 0 top
IC18  1489N  [DIL14']  109.86,225.93 0 top
IC19  74LS06N  [DIL14]  206.5,78.23 270 top
IC20  74LS06N  [DIL14]  207.65,51.69 270 top
IC21  74LS11N  [DIL14]  71.88,115.19 0 top
IC22  74LS373N  [DIL20]  190.5,199.14 0 top
IC23  74LS373N  [DIL20]  220.22,199.39 0 top
IC24  74LS244N  [DIL20]  190.5,218.44 0 top
IC25  74LS244N  [DIL20]  220.22,218.44 0 top
IC26  NE556  [DIL14]  49.78,212.72 270 top
IC27  [DIL14]  62.36,229.87 270 top
IC28  74HCT245N  [DIL20]  13.84,49.15 0 top
IC29  74HCT245N  [DIL20]  41.53,49.15 0 top
IC30  74LS03  [SO14]  24.13,35.18 0 top
IC31  39SF020  [DIL32]  67.31,55.37 270 top
IC32  39SF020  [DIL32]  92.96,55.37 270 top
IC33  74LVC1GU04  [SOT23-5]  212.47,33.15 0 top
ISA1  [ISA-16]  106.68,6.35 180 top
J1  AUDIO_JACK_3.5MM_KIT  [AUDIO-JACK-KIT]  4.7,110.11 0 top
J3  [DB9_MALE]  9.78,210.31 90 top
J4  MIDI_OUT  [DIN5]  7.24,151.64 90 top
J5  MIDI_IN  [DIN5]  7.24,128.14 90 top
J6  [DB9_MALE]  9.78,179.07 90 top
JP1  [1X02]  42.8,200.91 90 top
JP2  [1X02]  167.26,45.21 0 top
JP3  ISP  [1X05]  29.59,227.84 0 top
JP4  [2X20]  29.21,65.53 0 top
JP5  [2X17]  224.54,64.52 90 top
JP6  [2X10]  167.26,61.72 270 top
JP7  RS232  [2X13]  102.11,236.73 0 top
JP8  LPT  [2X13]  44.2,121.79 270 top
JP9  [2X20]  211.58,135.89 180 top
JP10  [1X02]  52.7,74.42 270 top
JP11  [1X03]  74.17,106.93 180 top
JP12  [1X03]  104.39,69.34 270 top
JP13  [1X03]  152.53,236.09 90 top
JP14  [1X02]  118.36,21.46 0 top
L1  [0204/7]  19.68,132.21 90 top
L2  [0204/7]  49.66,112.65 90 top
L3  220uH  [0204/7]  69.6,233.81 270 top
L4  [0204/7]  45.85,102.36 0 top
L5  opt  [0204/7]  205.99,32.38 270 top
OK1  PC900  [DIL06]  25.65,123.06 0 top
PWR  [SJ]  25.65,70.23 0 bottom
Q1  4MHz  [QS]  28.45,183.51 0 top
Q2  [QS]  219.2,33.66 90 top
Q3  2N3906  [TO92]  48.26,70.36 0 top
R1  68  [R0805]  198.12,169.04 270 bottom
R2  68  [R0805]  195.83,169.04 270 bottom
R3  5k1  [R0805]  39.62,104.01 90 bottom
R4  3k6  [R0805]  39.62,108.46 270 bottom
R5  68  [R0805]  187.58,169.04 270 bottom
R6  68  [R0805]  189.87,169.04 270 bottom
R7  1k  [R0805]  102.36,190.63 90 bottom
R8  1k  [R0805]  112.52,195.83 270 bottom
R9  1k  [R0805]  101.22,196.72 180 bottom
R10  1k  [R0805]  152.15,82.55 90 bottom
R11  4k7  [R0805]  115.06,195.83 270 bottom
R12  1k  [R0805]  104.9,195.83 270 bottom
R13  3k6  [0204/5]  85.85,103.63 90 top
R14  7k5  [0204/5]  83.31,103.63 90 top
R15  15k  [0204/5]  80.77,103.63 90 top
R16  3k6  [0204/5]  93.47,103.63 90 top
R17  7k5  [0204/5]  90.93,103.63 90 top
R18  15k  [0204/5]  88.39,103.63 90 top
R19  3k6  [0204/5]  101.09,103.63 90 top
R20  7k5  [0204/5]  98.55,103.63 90 top
R21  15k  [0204/5]  96.01,103.63 90 top
R22  10k  [R0805]  52.83,87.38 90 bottom
R23  1k  [R0805]  33.27,159 90 bottom
R24  4k7  [R0805]  28.19,159 90 bottom
R25  220  [R0805]  18.29,153.42 180 bottom
R26  220  [R0805]  18.29,151 180 bottom
R27  220  [R0805]  20.07,122.17 270 bottom
R28  220  [R0805]  18.16,141.1 180 bottom
R29  220  [R0805]  18.16,143.76 180 bottom
R30  4k7  [R0805]  207.52,56.77 180 bottom
R31  1k  [R0805]  207.52,59.31 180 bottom
R32  47  [0204/5]  210.82,65.15 180 top
R33  47  [0204/5]  210.82,67.82 180 top
R34  1k  [R0805]  193.29,76.96 180 bottom
R35  1k  [R0805]  193.29,72.01 180 bottom
R36  1k  [R0805]  193.29,74.42 180 bottom
R37  220  [R0805]  193.29,61.72 180 bottom
R38  1k  [R0805]  206.5,83.31 180 bottom
R39  1k  [R0805]  27.3,114.17 270 bottom
R40  3k  [R0805]  22.48,114.17 270 bottom
R41  8k2  [R0805]  15.88,112.78 0 bottom
R42  820  [R0805]  15.88,110.49 0 bottom
R43  220  [R0805]  20.07,114.17 270 bottom
R44  10k  [R0805]  177.42,131.44 180 bottom
R45  10k  [R0805]  177.42,128.02 180 bottom
R46  10k  [R0805]  177.42,124.97 180 bottom
R47  100  [R0805]  35.31,109.47 0 bottom
R48  2k4  [R0805]  84.45,111 90 bottom
R49  2k4  [R0805]  90.81,111 90 bottom
R50  2k4  [R0805]  96.9,111 90 bottom
R51  27  [R0805]  31.62,103.89 90 bottom
R52  5k1  [R0805]  39.62,95.25 90 bottom
R53  3k6  [R0805]  39.62,99.57 270 bottom
R54  100  [R0805]  35.31,100.58 0 bottom
R55  27  [R0805]  31.62,96.77 90 bottom
R56  5k1  [R0805]  39.62,86.23 90 bottom
R57  3k6  [R0805]  39.62,90.55 270 bottom
R58  100  [R0805]  35.31,91.57 0 bottom
R59  27  [R0805]  31.62,87.63 90 bottom
R60  1k  [R0805]  39.62,81.15 90 bottom
R61  1k  [R0805]  39.62,76.83 90 bottom
R62  100  [R0805]  35.31,81.79 0 bottom
R63  27  [R0805]  31.37,77.98 90 bottom
R64  12k  [R0805]  56.77,216.66 90 bottom
R65  12k  [R0805]  41.78,221.36 0 bottom
R66  10k  [R0805]  42.67,211.84 90 bottom
R67  5.1  [0204/7]  72.14,233.81 270 top
R68  12k  [R0805]  55.24,232.66 270 bottom
R69  1k2  [R0805]  55.24,237.87 270 bottom
R70  470  [R0805]  59.69,211.71 90 bottom
R71  47  [R0805]  28.96,106.81 0 top
R72  47  [R0805]  28.96,101.09 0 top
R73  47  [R0805]  28.96,95.63 0 top
R74  100  [R0805]  19.43,81.03 270 bottom
R75  150  [R0805]  15.24,73.03 0 bottom
R76  10k  [R0805]  22.73,77.09 90 bottom
R77  2k2  [R0805]  20.95,24.64 0 top
R78  2k2  [R0805]  20.95,29.08 180 top
R79  4k7  [R0805]  20.95,26.92 180 top
R80  4k7  [R0805]  106.68,7.11 270 bottom
R81  10k  [R0805]  182.5,28.19 0 bottom
R82  4k7  [R0805]  182.25,19.81 180 bottom
R83  100  [R0805]  42.8,70.48 180 bottom
R84  470  [R0805]  53.34,70.36 0 bottom
R85  1M  [R0805]  215.65,33.53 270 top
RN1  10k  [RN-10]  18.16,209.55 270 top
RN2  10k  [RN-10]  38.1,201.93 270 top
RN3  10k  [RN-9]  136.4,205.74 90 top
RN4  10k  [RN-9]  138.94,227.33 270 top
RN5  4k7  [RN-9]  140.59,204.47 90 top
RN6  10k  [RN-9]  169.29,179.07 270 top
RN7  10k  [RN-9]  169.29,156.21 90 top
RN8  10k  [RN-9]  140.08,158.75 270 top
RN9  4k7  [RN-9]  136.91,174.88 270 top
RN10  4k7  [RN-10]  160.53,65.53 270 top
T1  2N3904  [TO92]  20.95,107.7 270 top
T2  2N3904  [TO92]  35.05,105.54 270 top
T3  2N3904  [TO92]  35.05,96.52 270 top
T4  2N3904  [TO92]  35.05,87.5 270 top
T5  2N3904  [TO92]  34.92,77.47 270 top
T6  2N3904  [TO92]  17.78,76.07 0 top
T7  2N3904  [TO92]  176.53,27.3 270 top
U$6  Monitor  [DIN-13]  10.16,93.98 90 top
VGA  [2X08]  23.62,92.58 270 top
X1  TC46C  [TC46]  218.19,33.53 0 top
X2  2.4576MHz  [QS]  100.33,210.31 0 top
X3  [SSV-BD06]  0.13,234.7 270 top
X4  5566-20  [5566-20]  202.69,236.22 180 top

## Tracks (layer width: path | path; a pad name or v marks a point on that pad's centre or on a via)
2MHZ  (via drill 0.5)
  Top 0.254: IC5.54 132.08,107.44 130.81,108.71 130.81,110.62 123.32,118.11 118.75,118.11 118.11,118.75 118.11,119.89 117.35,120.65 115.06,120.65 114.43,121.28 114.43,123.44 108.58,129.29 98.3,129.29 v97.92,129.67
  Bottom 0.254: v97.92,129.67 97.92,134.11 97.28,134.75 IC7.22
4MHZ  (via drill 0.5)
  Top 0.254: IC6.19 191.13,176.02 190.75,176.4 190.75,180.59 189.99,181.36 175.77,181.36 171.7,185.42 163.7,185.42 158.62,190.5 135.38,190.5 133.99,191.9 93.85,191.9 v93.22,192.53 | v93.22,196.47 92.71,196.98 90.55,196.98 89.66,197.87 IC3.35
  Bottom 0.254: v93.22,192.53 v93.22,196.47
8MHZ  (via drill 0.5)
  Top 0.254: v183.77,186.69 179.45,186.69 173.35,192.79 v171.58,192.79 | v156.72,191.77 IC4.15 | IC6.20 189.23,178.31 188.09,177.16 185.8,177.16 185.42,176.78 185.42,167.26 187.2,165.48 187.2,158.24 185.42,156.46 185.42,149.73 189.99,145.16 189.99,143.89 v184.28,138.18 | v173.74,83.69 173.23,84.2 162.18,84.2 160.02,82.04 IC9.39 | IC5.34 122.17,121.92 133.35,110.74 137.54,110.74 138.43,109.86 138.43,108.46 138.94,107.95 162.18,107.95 162.81,107.31 v184.66,107.31
  Top 0.305: IC10.18 185.04,59.18 183.77,60.45 175.51,60.45 v174.75,61.21
  Bottom 0.254: IC6.20 189.23,181.23 v183.77,186.69 | v171.58,192.79 157.73,192.79 v156.72,191.77 | v184.28,138.18 184.28,135.89 186.06,134.11 186.06,126.87 184.66,125.48 v184.66,107.31 184.66,102.49 173.74,91.57 v173.74,83.69
  Bottom 0.305: v173.74,83.69 173.74,75.56 175.01,74.3 175.01,61.47 v174.75,61.21 175.01,60.96 175.01,33.78 178.82,29.97 186.82,29.97 187.71,29.08 187.71,14.73 186.69,13.72 IC12.1
16MHZ  (via drill 0.5)
  Top 0.254: v191.52,173.48 191.39,173.48 190.25,174.62 190.25,179.71 189.36,180.59 174.62,180.59 172.34,182.88 141.73,182.88 140.59,181.74 140.59,179.45 139.83,178.69 v130.05,178.69
  Top 0.305: v124.84,156.97 v55.12,156.97
  Bottom 0.254: v130.05,178.69 130.05,165.1 129.54,164.59 127.51,164.59 125.6,162.69 125.6,157.73 v124.84,156.97 | v55.12,156.97 55.12,149.61 55.37,149.35 IC8.39
  Bottom 0.305: v191.52,173.48 194.94,173.48 196.22,174.75 205.87,174.75 206.5,174.12 206.5,171.58 205.87,170.94 IC6.5
32MHZ  (via drill 0.5)
  Top 0.406: v56.64,79.38 56.77,79.25 105.41,79.25 v106.81,77.85 | v106.81,34.54 186.18,34.54 187.83,36.2 L5.1 Q2.2 | X1.8 224.66,36.2 Q2.2 | C71.1 219.84,34.42 219.2,35.05 | 219.2,35.05 Q2.2 | IC33.4 215.62,34.45 R85.1 218.63,34.48 219.2,35.05
  Bottom 0.406: IC8.2 55.37,80.64 v56.64,79.38 | v106.81,77.85 107.44,77.22 107.44,65.28 105.79,63.63 105.79,35.56 v106.81,34.54
500KHZ  (via drill 0.5)
  Top 0.254: v56.64,151.13 57.02,151.51 82.17,151.51 82.55,151.13 v94.49,151.13 | IC1.3 IC1.4 | IC2.3 IC2.4 | IC5.43 113.03,109.22 108.97,113.28 108.97,120.02 104.78,124.21 v96.01,124.21
  Bottom 0.254: IC2.3 v56.64,151.13 | v94.49,151.13 94.74,150.88 IC1.4 96.01,146.3 v96.01,124.21
6850CS  (via drill 0.5)
  Top 0.254: IC2.8 69.34,149.48 69.98,150.11 81.53,150.11 82.17,149.48 104.65,149.48 104.9,149.22 IC1.8 | v107.7,106.68 111.12,106.68 v111.89,105.92
  Bottom 0.254: IC1.8 104.9,140.21 104.01,139.32 104.01,110.36 v107.7,106.68 | IC5.42 118.24,110.62 118.24,108.33 117.73,107.82 115.44,107.82 113.54,105.92 v111.89,105.92
!BG
  Bottom 0.254: IC5.27 116.84,132.72 119.38,135.25 119.38,136.53 124.21,141.35 128.4,141.35 129.03,141.99 129.03,161.04 130.56,162.56 131.06,162.56 131.95,163.45 131.95,193.42 132.84,194.31 138.05,194.31 139.32,195.58 144.91,195.58 145.41,196.09 145.41,201.55 145.03,201.93 IC4.11 RN5.4
!BGACK
  Bottom 0.254: IC5.41 114.17,111.76 112.9,113.03 112.9,136.27 126.24,149.61 126.24,162.43 127.76,163.96 130.3,163.96 130.94,164.59 130.94,195.96 134.37,199.39 RN5.3 IC4.12
!BLANK  (via drill 0.5)
  Top 0.254: IC5.36 119.38,119.51 118.24,120.65 118.24,122.56 117.6,123.19 115.32,123.19 115.06,123.44 115.06,124.59 109.73,129.92 101.35,129.92 100.71,130.56 v92.33,130.56 | v87.12,113.79 v93.47,113.79 v99.44,113.79
  Bottom 0.254: v92.33,130.56 92.33,125.6 93.47,124.46 93.47,116.84 | 93.47,116.84 v93.47,113.79 | v93.47,113.79 D6.C 93.42,113.71 v93.47,113.79 | 93.6,116.97 93.47,116.84 | D5.C 87.04,113.71 v87.12,113.79 | D7.C 99.52,113.71 v99.44,113.79
!BR
  Top 0.305: RN5.2 IC4.13
  Bottom 0.254: IC5.40 118.11,113.03 114.3,113.03 113.54,113.79 113.54,136.14 126.87,149.48 126.87,162.05 128.02,163.19 130.68,163.19 131.44,163.96 131.44,193.93 134.24,196.85 RN5.2
!DIR  (via drill 0.5)
  Top 0.305: IC19.6 204.98,73.15 206.25,74.42 214.25,74.42 v214.76,73.91 | v215.26,64.52 JP5.18
  Bottom 0.305: v214.76,73.91 214.76,65.02 v215.26,64.52
!DRV0  (via drill 0.5)
  Top 0.305: v98.42,119 99.19,118.24 105.92,118.24 107.06,117.09 107.06,111.89 115.44,103.5 166.75,103.5 v167.26,103 | v167.26,85.22 167.64,84.84 178.31,84.84 179.83,83.31 199.01,83.31 200.28,82.04 v218.69,82.04 | v219.07,59.44 JP5.14
  Bottom 0.305: IC7.19 97.28,120.14 v98.42,119 | v167.26,103 v167.26,85.22 | v218.69,82.04 218.69,59.82 v219.07,59.44
!DRV1  (via drill 0.5)
  Top 0.305: v100.2,119.13 106.55,119.13 107.7,117.98 107.7,112.39 115.7,104.39 167.77,104.39 v168.66,103.5 | v168.66,86.23 169.29,85.6 171.32,85.6 171.58,85.85 199.14,85.85 200.41,84.58 219.46,84.58 220.09,83.95 v220.09,83.57
  Bottom 0.305: IC7.20 99.82,119.51 v100.2,119.13 | v168.66,103.5 v168.66,86.23 | v220.09,83.57 220.09,61.21 220.6,60.71 220.6,58.04 221.62,56.9 JP5.12
!INDEX  (via drill 0.5)
  Top 0.305: JP5.8 222,51.82 220.85,52.96 202.56,52.96 v201.29,54.23
  Bottom 0.305: R36.2 IC10.24 199.14,74.42 200.28,73.28 200.28,65.66 201.29,64.64 v201.29,54.23
!MOTEB
  Top 0.305: IC20.12 223.14,54.23 JP5.10
  Bottom 0.305: JP5.10 223.9,54.36 224.54,54.99 224.54,61.34 223.9,61.98 JP5.16
!RDATA  (via drill 0.5)
  Top 0.305: JP5.30 216.15,79.76 v215.26,78.87 | v214.88,61.72 IC10.19
  Bottom 0.305: R37.2 IC10.19 | v215.26,78.87 215.26,76.83 216.41,75.69 216.41,63.25 v214.88,61.72
!SIDE0
  Top 0.305: JP5.32 222.25,82.3 220.73,80.77 IC19.12
!STEP
  Top 0.305: R32.1 214.12,65.15 216.03,67.06 JP5.20
!TRACK0
  Top 0.305: JP5.26 219.07,74.68 216.28,71.88 IC10.23
  Bottom 0.305: IC10.23 194.37,71.88 R35.2
!WDATA
  Top 0.305: R33.1 214.5,67.82 216.28,69.6 JP5.22
!WGATE
  Top 0.305: JP5.24 218.19,72.14 216.66,70.61 IC19.8
!WP
  Top 0.305: JP5.28 220.98,77.22 220.73,76.96 IC10.25
  Bottom 0.305: IC10.25 R34.2
+12V
  Top 0.406: IC27.6 61.85,224.79 62.99,223.65 C52.+ 65.91,220.34 77.6,220.34 78.49,221.23 78.49,229.11 79.12,229.74 IC17.14
  Bottom 0.305: R70.2 62.55,212.66 62.99,213.11 62.99,214.31 C54.1
  Bottom 0.406: R68.2 55.24,226.06 56.52,224.79 IC27.6 | C54.1 62.93,217.36 C52.+
+12V_ATX
  Top 0.61: X4.10 229.28,238.97 230.63,237.62 230.63,232.03 233.04,229.62 237.24,229.62 239.27,227.58 239.27,189.23 241.3,187.2 241.3,183.9 239.27,181.86 239.27,144.65 241.17,142.75 241.17,138.56 239.27,136.65 239.27,90.04 232.41,83.19 232.41,30.61 223.27,21.46 223.27,11.05 214.25,2.03 46.1,2.03 45.72,2.41 ISA1.B9
-12V
  Top 0.406: C51.- 79.5,215.77 80.77,217.04 IC17.1
  Bottom 0.406: C51.- D8.A 73.84,218.44 C53.1
-12V_ATX
  Top 0.61: X4.12 187.99,234.85 189.99,236.85 189.99,240.92 190.63,241.55 197.99,241.55 198.63,240.92 198.63,237.87 199.77,236.73 210.06,236.73 211.2,237.87 211.2,240.54 212.22,241.55 230.38,241.55 232.66,239.27 232.66,233.43 234.31,231.78 238.12,231.78 241.3,228.6 241.3,189.36 242.7,187.96 242.7,182.88 241.3,181.48 241.3,145.16 242.7,143.76 242.7,136.78 241.17,135.25 241.17,89.92 233.68,82.42 233.68,29.72 224.66,20.7 224.66,10.29 215.39,1.02 41.15,1.02 40.64,1.52 ISA1.B7
A1  (via drill 0.5)
  Top 0.254: IC31.12 71.37,46.48 72.39,47.5 82.8,47.5 83.82,46.48 IC32.12 87.63,46.48 88.65,47.5 v115.06,47.5 | IC4.29 RN8.6 v134.11,156.21 133.1,155.19 v112.52,155.19 77.09,155.19 | v46.35,158.62 46.86,158.12 49.66,158.12 52.58,155.19 77.09,155.19 | v76.96,155.19 76.96,155.07 77.09,155.19 | v77.22,114.55 63.5,114.55 v62.99,114.05 | v29.46,147.32 29.84,147.7 44.83,147.7 v45.97,148.84 | IC9.2 v115.06,82.04
  Top 0.305: v187.2,145.54 181.23,145.54 180.59,144.91 178.44,144.91 177.8,145.54 171.83,145.54 171.2,144.91 137.92,144.91 v137.16,145.67
  Top 0.406: v99.95,23.24 v114.3,23.24
  Bottom 0.254: v115.06,47.5 v115.06,82.04 115.06,85.72 134.62,105.41 IC5.56 | v76.96,155.19 IC2.11 76.96,146.05 78.11,144.91 78.11,115.44 v77.22,114.55 | IC1.11 v112.52,155.19 | v62.99,114.05 IC8.36 | IC16.11 30.73,140.84 29.46,142.11 v29.46,147.32 | v45.97,148.84 46.35,149.22 v46.35,158.62 46.35,175.9 53.21,182.75 58.55,182.75 59.18,183.39 IC3.2
  Bottom 0.305: v134.11,156.21 133.1,155.19 133.1,127.25 130.94,125.09 130.94,113.92 133.1,111.76 133.1,108.2 IC5.56 | IC6.50 189.23,147.57 v187.2,145.54 | v137.16,145.67 137.16,155.57 137.79,156.21 RN8.6
  Bottom 0.406: v114.3,23.24 114.3,28.07 115.06,28.83 v115.06,47.5 | ISA1.A30 99.06,22.35 v99.95,23.24
A2  (via drill 0.5)
  Top 0.254: IC31.11 71.12,49.02 72.14,50.04 82.8,50.04 83.82,49.02 IC32.11 98.3,49.02 99.31,50.04 115.57,50.04 v116.08,49.53 | IC4.30 RN8.7 v135.13,153.67 135,153.54 131.06,153.54 130.3,154.31 v107.44,154.31 v74.42,154.31 52.2,154.31 49.78,156.72 47.62,156.72 v47.24,157.1 | IC8.35 65.53,95.12 66.17,94.49 124.97,94.49 v125.35,94.87
  Top 0.305: v183.9,147.83 183.64,147.57 181.86,147.57 181.23,148.21 176.91,148.21 176.28,147.57 167.39,147.57 166.88,147.07 146.94,147.07 v146.56,147.45 | JP4.35 46.99,65.53 44.83,65.53 44.45,65.15 44.45,63.12 46.35,61.21 47.75,61.21 56.52,52.45 56.52,50.04 57.53,49.02 IC31.11
  Top 0.406: v98.42,24.26 v115.44,24.26
  Bottom 0.254: v116.08,49.53 116.08,85.6 v125.35,94.87 135.89,105.41 135.89,107.19 134.62,108.46 IC5.57 | v47.24,157.1 47.24,175.77 53.59,182.12 60.71,182.12 61.85,183.26 61.85,184.4 IC3.3 | IC2.10 v74.42,154.31 | IC1.9 v107.44,154.31
  Bottom 0.305: v135.13,153.67 133.6,152.15 133.6,127.64 135.89,125.35 135.89,111.63 134.62,110.36 IC5.57 | IC6.49 186.69,155.45 185.42,154.18 185.42,149.35 v183.9,147.83 | v146.56,147.45 146.43,147.57 146.43,153.16 145.92,153.67 IC4.30
  Bottom 0.406: ISA1.A29 96.52,22.35 v98.42,24.26 | v115.44,24.26 115.44,27.3 116.08,27.94 v116.08,49.53
A3  (via drill 0.5)
  Top 0.254: IC31.10 71.12,51.56 72.14,52.58 82.8,52.58 83.82,51.56 IC32.10 96.27,51.56 97.28,52.58 116.84,52.58 v117.09,52.32 | IC4.31 RN8.8 v135.25,151.13 131.7,151.13 129.41,153.42 51.94,153.42 49.91,155.45 48.51,155.45 v48.13,155.83 | IC8.34 68.07,95.76 68.83,95 124.33,95 124.97,95.63 v127.38,95.63
  Top 0.305: v185.17,146.81 184.91,146.56 181.86,146.56 180.85,147.57 177.16,147.57 176.66,147.07 167.64,147.07 166.37,145.8 138.81,145.8 v138.18,146.43 | JP4.33 45.72,63.5 47.24,61.98 48.39,61.98 57.66,52.7 57.66,52.2 58.29,51.56 IC31.10
  Top 0.406: v95.25,25.27 v116.59,25.27
  Bottom 0.254: v117.09,52.32 117.09,85.34 v127.38,95.63 137.16,105.41 IC5.58 | v48.13,155.83 48.13,175.64 53.98,181.48 62.61,181.48 64.26,183.13 IC3.4 | v138.18,146.43 138.18,150.75 138.56,151.13 RN8.8
  Bottom 0.305: v135.25,151.13 135.25,144.15 135.64,143.76 135.64,126.49 136.53,125.6 136.53,111.12 135.89,110.49 135.89,108.71 137.16,107.44 IC5.58 | IC6.48 186.69,148.34 v185.17,146.81
  Bottom 0.406: ISA1.A28 93.98,24 v95.25,25.27 | v116.59,25.27 117.09,25.78 v117.09,52.32
A4  (via drill 0.5)
  Top 0.254: IC31.9 71.63,54.1 72.64,55.12 82.8,55.12 83.82,54.1 IC32.9 97.54,54.1 98.55,55.12 117.35,55.12 v118.11,54.36 | IC4.32 RN8.9 v136.14,148.59 132.46,148.59 128.27,152.78 51.44,152.78 50.16,154.05 49.4,154.05 v49.02,154.43 | IC8.33 70.61,96.14 71.25,95.5 123.95,95.5 124.84,96.39 v129.41,96.39
  Top 0.305: v180.85,149.86 146.18,149.86 144.91,148.59 IC4.32 | JP4.36 49.53,65.53 49.53,62.61 58.04,54.1 IC31.9
  Top 0.406: v92.71,25.91 93.22,26.42 116.97,26.42 v118.11,27.56
  Bottom 0.254: v118.11,54.36 118.11,84.96 v129.41,96.39 138.43,105.41 138.43,107.95 IC5.59 | v49.02,154.43 49.02,175.51 54.36,180.85 63.12,180.85 IC3.5
  Bottom 0.305: v136.14,148.59 136.14,126.87 137.16,125.86 IC5.59 | IC6.47 184.15,155.45 182.88,154.18 182.88,151.89 v180.85,149.86
  Bottom 0.406: ISA1.A27 91.44,24.51 v92.71,25.91 | v118.11,27.56 v118.11,54.36
A5  (via drill 0.5)
  Top 0.254: IC31.8 71.88,56.64 72.9,57.66 82.8,57.66 83.82,56.64 IC32.8 v90.42,56.64 96.27,56.64 97.28,57.66 v119,57.66 | v182.37,148.84 171.32,148.84 171.07,148.59 RN7.2 IC4.33 145.92,148.59 144.65,147.32 132.33,147.32 127.51,152.15 50.67,152.15 v49.91,152.91 | IC3.6 69.34,183.13 68.96,182.75 67.56,182.75 v66.17,181.36 | IC8.32 73.15,96.39 73.53,96.01 123.57,96.01 124.71,97.16 v131.44,97.16 | IC11.11 162.31,106.05 v161.67,106.68
  Top 0.305: v161.67,106.68 IC5.60
  Bottom 0.254: v119,57.66 119,84.45 v131.44,97.16 139.7,105.41 IC5.60 | v49.91,152.91 49.91,175.39 54.74,180.21 65.02,180.21 v66.17,181.36
  Bottom 0.305: IC4.33 166.37,147.83 165.35,146.81 165.35,110.36 v161.67,106.68 | IC6.46 184.15,150.62 v182.37,148.84
  Bottom 0.406: ISA1.A26 88.9,32.13 90.42,33.66 v90.42,56.64
A6  (via drill 0.5)
  Top 0.254: IC31.7 70.61,59.18 71.63,60.2 82.8,60.2 83.82,59.18 IC32.7 v89.53,59.18 96.27,59.18 97.28,60.2 102.62,60.2 103.12,59.69 v120.9,59.69 | 179.58,153.67 174.24,153.67 171.7,151.13 RN7.3 IC4.34
  Top 0.305: v162.56,109.22 IC5.61 | IC6.45 179.58,153.67
  Bottom 0.254: v120.9,59.69 120.9,84.07 142.24,105.41 IC5.61
  Bottom 0.305: IC4.34 165.1,151.13 164.59,150.62 164.59,111.25 v162.56,109.22
  Bottom 0.406: ISA1.A25 86.36,31.75 89.53,34.92 v89.53,59.18
A7  (via drill 0.5)
  Top 0.254: IC31.6 71.12,61.72 72.14,62.74 82.68,62.74 83.69,61.72 IC32.6 v88.65,61.72 95.5,61.72 96.52,62.74 102.62,62.74 103.12,62.23 v119.89,62.23 | IC6.43 174.12,155.7 172.09,153.67 RN7.4 IC4.35
  Top 0.305: v162.94,111.38 162.05,110.49 140.97,110.49 IC5.62
  Bottom 0.254: v119.89,62.23 119.89,84.2 141.22,105.66 141.22,107.7 IC5.62
  Bottom 0.305: IC4.35 164.59,153.67 163.83,152.91 163.83,112.27 v162.94,111.38
  Bottom 0.406: ISA1.A24 83.82,30.61 88.65,35.43 v88.65,61.72
A8  (via drill 0.5)
  Top 0.254: IC31.5 70.48,64.26 71.75,65.53 v77.85,65.53 82.55,65.53 83.82,64.26 IC32.5 95.5,64.26 96.77,65.53 101.73,65.53 102.49,64.77 106.3,64.77 107.06,65.53 129.67,65.53 v129.92,65.79 | 180.34,156.97 172.47,156.97 171.7,156.21 RN7.5 IC4.36
  Top 0.305: v161.8,112.27 161.29,111.76 IC5.63 | IC6.42 180.34,156.97
  Bottom 0.254: v129.92,65.79 129.92,80.26 v161.8,112.27
  Bottom 0.305: IC4.36 164.08,156.21 163.07,155.19 163.07,113.54 v161.8,112.27
  Bottom 0.406: ISA1.A23 81.28,35.31 79.76,36.83 79.76,43.56 78.23,45.09 78.23,65.15 v77.85,65.53
A9  (via drill 0.5)
  Top 0.254: IC31.27 v77.22,61.72 82.8,61.72 83.82,60.71 95.25,60.71 96.27,61.72 IC32.27 114.55,61.72 115.06,61.21 127.13,61.21 v127.89,61.98 | IC6.41 172.09,158.24 171.58,158.75 RN7.6 IC4.37
  Top 0.305: v160.53,113.54 160.02,113.03 140.97,113.03 IC5.64
  Bottom 0.254: v127.89,61.98 128.91,62.99 128.91,80.52 160.53,112.27 v160.53,113.54
  Bottom 0.305: IC4.37 164.34,158.75 162.31,156.72 162.31,115.32 v160.53,113.54
  Bottom 0.406: ISA1.A22 78.74,43.18 77.47,44.45 77.47,61.47 v77.22,61.72
A10  (via drill 0.5)
  Top 0.254: IC31.26 82.8,59.18 83.82,58.17 96.01,58.17 97.03,59.18 IC32.26 120.02,59.18 120.52,58.67 125.86,58.67 v126.62,59.44 | IC6.40 180.34,159.51 172.97,159.51 171.2,161.29 RN7.7 IC4.38
  Top 0.305: v158.5,114.3 IC5.65
  Bottom 0.254: v126.62,59.44 126.62,62.48 128.14,64.01 128.14,81.03 158.5,111.51 v158.5,114.3
  Bottom 0.305: IC4.38 164.34,161.29 161.54,158.5 161.54,117.35 v158.5,114.3
  Bottom 0.406: ISA1.A21 76.2,32.77 76.71,33.27 76.71,58.93 76.45,59.18 IC31.26
A11  (via drill 0.5)
  Top 0.254: IC31.23 83.06,51.56 84.07,50.55 96.27,50.55 97.28,51.56 IC32.23 125.35,51.56 v125.6,51.82 | IC6.39 173.86,160.78 170.81,163.83 RN7.8 IC4.39
  Top 0.305: v157.23,115.57 140.97,115.57 IC5.66
  Bottom 0.254: v125.6,51.82 125.6,62.61 127.25,64.26 127.25,81.53 157.23,111.51 v157.23,115.57
  Bottom 0.305: IC4.39 164.34,163.83 160.78,160.27 160.78,119.13 v157.23,115.57
  Bottom 0.406: ISA1.A20 73.66,31.62 72.9,32.38 72.9,51.05 73.41,51.56 IC31.23
A12  (via drill 0.5)
  Top 0.254: IC31.25 82.8,56.64 83.82,55.63 96.27,55.63 97.28,56.64 IC32.25 v124.21,56.64 | IC6.38 180.34,162.05 175.01,162.05 170.69,166.37 RN7.9 IC4.40
  Top 0.305: v155.96,116.84 IC5.67
  Bottom 0.254: v124.21,56.64 124.21,62.36 126.36,64.52 126.36,81.92 155.96,111.51 v155.96,116.84
  Bottom 0.305: IC4.40 164.34,166.37 160.02,162.05 160.02,120.9 v155.96,116.84
  Bottom 0.406: ISA1.A19 71.12,33.27 72.14,34.29 72.14,55.5 73.28,56.64 IC31.25
A13  (via drill 0.5)
  Top 0.254: IC31.4 70.48,66.8 71.75,68.07 82.55,68.07 83.82,66.8 IC32.4 95.5,66.8 96.77,68.07 124.71,68.07 v125.48,68.83 | IC4.41 RN6.9 171.07,168.91 171.7,168.28 171.7,166.75 175.13,163.32 IC6.37
  Top 0.305: v154.81,117.86 154.56,118.11 140.97,118.11 IC5.68
  Top 0.406: v67.82,11.94 62.61,11.94 v61.98,12.57
  Bottom 0.254: v125.48,68.83 125.48,82.3 154.81,111.63 v154.81,117.86
  Bottom 0.305: IC4.41 164.34,168.91 159.26,163.83 159.26,122.3 v154.81,117.86
  Bottom 0.406: ISA1.A18 68.58,11.18 v67.82,11.94 | v61.98,12.57 61.98,66.17 61.34,66.8 IC31.4
A14  (via drill 0.5)
  Top 0.254: IC6.36 180.34,164.59 175.26,164.59 173.48,166.37 173.48,170.94 172.97,171.45 RN6.8 IC4.42 | IC31.28 82.68,64.26 83.69,63.25 95.25,63.25 96.27,64.26 IC32.28 124.33,64.26 v124.59,64.52 | IC11.10 168.66,108.58 167.77,109.47 167.77,119.76 166.62,120.9 v154.43,120.9
  Top 0.305: v154.43,120.9 154.18,120.65 141.22,120.65 IC5.2
  Top 0.406: v63.63,63.37 63.75,63.5 70.87,63.5 71.63,64.26 IC31.28
  Bottom 0.254: v124.59,64.52 124.59,82.68 153.67,111.76 153.67,120.14 v154.43,120.9
  Bottom 0.305: IC4.42 164.34,171.45 158.5,165.61 158.5,124.97 v154.43,120.9
  Bottom 0.406: ISA1.A17 66.04,23.62 63.5,26.16 63.5,63.25 v63.63,63.37
A15  (via drill 0.5)
  Top 0.254: IC31.29 82.42,66.8 83.69,65.53 95.5,65.53 96.77,66.8 IC32.29 101.35,66.8 102.87,65.28 106.05,65.28 107.57,66.8 123.44,66.8 v123.7,67.06 | IC6.35 175.01,165.86 173.99,166.88 173.99,172.97 172.97,173.99 RN6.7 IC4.43 | v153.67,122.68 166.62,122.68 168.28,121.03 168.28,112.01 169.16,111.12 IC11.9
  Top 0.305: v153.67,122.68 152.91,121.92 IC5.3
  Top 0.406: v63.5,65.91 70.74,65.91 71.63,66.8 IC31.29
  Bottom 0.254: v123.7,67.06 123.7,83.06 152.65,112.01 152.65,121.67 v153.67,122.68
  Bottom 0.305: IC4.43 164.34,173.99 157.73,167.39 157.73,126.75 v153.67,122.68
  Bottom 0.406: ISA1.A16 63.5,23.5 62.74,24.26 62.74,65.15 v63.5,65.91
A16  (via drill 0.5)
  Top 0.254: IC31.3 70.99,69.34 72.26,70.61 82.55,70.61 83.82,69.34 IC32.3 95.5,69.34 96.77,70.61 122.17,70.61 v122.68,71.12 | IC4.44 RN6.6 | v151.64,123.19 152.15,123.7 167,123.7 168.78,121.92 168.78,114.3 169.42,113.67 IC11.8
  Top 0.305: v151.64,123.19 140.97,123.19 IC5.4 | v200.41,184.66 199.14,185.93 178.31,185.93 176.66,187.58 v176.66,187.83 | v124.84,19.94 155.83,19.94 161.29,25.4 168.78,25.4 170.31,23.88 v188.98,23.88
  Bottom 0.254: v122.68,71.12 122.68,83.31 151.64,112.27 v151.64,123.19 | 175.13,176.53 RN6.6
  Bottom 0.305: IC4.44 164.34,176.53 156.97,169.16 156.97,128.52 v151.64,123.19 | IC6.11 200.66,177.29 200.66,184.4 v200.41,184.66 | v176.66,187.83 176.66,178.05 175.13,176.53 | ISA1.A15 60.96,30.23 55.12,36.07 55.12,43.43 57.15,45.47 57.15,68.83 57.66,69.34 IC31.3 | v122.68,71.12 122.68,49.28 124.84,47.12 v124.84,19.94 | v188.98,23.88 189.23,23.62 IC12.23
A17  (via drill 0.5)
  Top 0.254: IC31.2 70.99,71.88 72.26,73.15 82.55,73.15 83.82,71.88 IC32.2 97.54,71.88 98.81,73.15 106.3,73.15 107.82,71.63 121.28,71.63 v121.79,72.14 | IC4.45 RN6.5 | v151.89,125.22 167.89,125.22 168.66,124.59 168.66,123.32 171.07,120.9 171.07,116.84 171.7,116.2 IC11.7
  Top 0.305: v151.89,125.22 151.13,124.46 IC5.5 | v198.37,184.91 198.12,185.17 178.05,185.17 175.64,187.58 v175.64,188.59 | ISA1.A14 58.42,6.73 59.31,5.84 124.46,5.84 125.73,7.11 125.73,10.54 126.11,10.92 129.16,10.92 129.54,10.54 ISA1.C8 129.54,7.37 129.92,6.99 158.62,6.99 162.18,10.54 172.34,10.54 174.88,8 v192.28,8
  Bottom 0.254: v121.79,72.14 121.79,83.69 150.62,112.52 150.62,123.95 v151.89,125.22 | 174.37,179.07 RN6.5
  Bottom 0.305: IC4.45 164.34,179.07 156.21,170.94 156.21,129.54 v151.89,125.22 | IC6.12 199.39,183.9 v198.37,184.91 | v175.64,188.59 175.64,180.34 174.37,179.07 | ISA1.A14 58.42,31.88 54.48,35.81 54.48,43.69 56.52,45.72 56.52,71.25 57.15,71.88 IC31.2 | v192.28,8 193.04,8.76 193.04,14.86 191.77,16.13 IC12.22
A18  (via drill 0.5)
  Top 0.254: RN6.4 IC4.46 | v151.89,126.75 152.02,126.87 168.91,126.87 169.67,126.11 169.67,123.32 171.83,121.16 171.83,119.13 172.21,118.75 IC11.6
  Top 0.305: v151.89,126.75 150.88,125.73 140.97,125.73 IC5.6 | v197.87,183.39 196.85,184.4 177.8,184.4 174.62,187.58 v174.62,187.83 | v188.21,7.11 174.62,7.11 172.09,9.65 162.43,9.65 159,6.22 127.76,6.22 127,6.99 127,7.11 | 127,7.11 ISA1.C7 | ISA1.A13 55.88,5.97 56.64,5.21 125.09,5.21 127,7.11 | v185.55,117.47 177.04,117.47 175.77,118.75 IC11.6
  Bottom 0.254: 173.35,181.61 RN6.4
  Bottom 0.305: IC4.46 164.34,181.61 155.45,172.72 155.45,130.3 v151.89,126.75 | IC6.13 198.12,177.29 198.12,183.13 v197.87,183.39 | v174.62,187.83 174.62,182.88 173.35,181.61 | v188.21,7.11 189.23,8.13 IC12.2 189.23,14.61 188.21,15.62 188.21,29.59 187.2,30.61 179.07,30.61 175.64,34.04 175.64,74.55 174.75,75.44 174.75,91.57 186.18,103 186.18,116.84 v185.55,117.47
A19  (via drill 0.5)
  Top 0.254: RN6.3 IC4.47 | IC11.5 172.97,121.28 170.31,123.95 170.31,127.13 169.54,127.89 151.38,127.89 v150.5,127
  Top 0.305: v150.5,127 IC5.7 | v196.09,183.39 195.83,183.64 177.55,183.64 173.61,187.58 v173.61,188.59 | v191.52,9.02 175.01,9.02 172.47,11.56 125.35,11.56 124.46,10.67 ISA1.C6 124.46,6.99 123.95,6.48 60.33,6.48 59.69,7.11 59.69,10.41 59.05,11.05 53.85,11.05 53.34,10.54 ISA1.A12 | v186.18,120.02 176.91,120.02 175.64,121.28 IC11.5
  Bottom 0.254: v173.61,188.59 173.61,185.04 172.72,184.15 RN6.3
  Bottom 0.305: IC4.47 164.08,184.15 154.69,174.75 154.69,131.19 v150.5,127 | IC6.14 196.85,182.63 v196.09,183.39 | v191.52,9.02 191.77,9.27 IC12.3 191.77,14.73 190.5,16 190.5,28.57 187.83,31.24 179.32,31.24 176.28,34.29 176.28,74.8 175.39,75.69 175.39,91.31 186.82,102.74 186.82,119.38 v186.18,120.02
A20  (via drill 0.5)
  Top 0.254: RN6.2 IC4.48 | IC11.4 172.34,123.83 171.07,125.09 171.07,128.14 170.43,128.78 v150.62,128.78
  Top 0.305: v150.62,128.78 150.11,128.27 140.97,128.27 IC5.8 | v195.33,182.12 194.56,182.88 177.29,182.88 172.59,187.58 v172.59,187.83 | v187.07,122.43 186.94,122.56 176.4,122.56 175.13,123.83 IC11.4
  Bottom 0.254: v172.59,187.83 172.59,187.07 172.21,186.69 RN6.2
  Bottom 0.305: IC4.48 164.08,186.69 153.92,176.53 153.92,132.08 v150.62,128.78 | IC6.15 196.85,176.28 195.58,177.55 195.58,181.86 v195.33,182.12 | IC12.4 194.31,14.99 193.04,16.26 193.04,24.77 192.15,25.65 192.15,28.45 188.72,31.88 179.58,31.88 176.91,34.54 176.91,74.93 176.02,75.82 176.02,91.06 187.45,102.49 187.45,122.05 v187.07,122.43
A21  (via drill 0.5)
  Top 0.254: IC11.3 172.47,126.36 171.83,127 171.83,129.16 170.94,130.05 149.86,130.05 v149.35,129.54
  Top 0.305: v149.35,129.54 IC5.9 | v193.04,181.86 192.79,182.12 176.78,182.12 171.2,187.71 171.2,190.75 170.18,191.77 IC4.50 | v187.58,124.97 176.15,124.97 174.75,126.36 IC11.3
  Bottom 0.254: R46.1 176.15,124.97 174.75,126.36 IC11.3
  Bottom 0.305: IC4.50 163.58,191.77 162.31,190.5 162.31,185.93 153.16,176.78 153.16,133.35 v149.35,129.54 | IC6.16 194.31,180.59 v193.04,181.86 | IC12.5 196.85,14.61 195.58,15.88 195.58,26.67 189.74,32.51 179.83,32.51 177.67,34.67 177.55,34.67 177.55,75.18 176.66,76.07 176.66,90.81 188.09,102.11 188.09,124.46 v187.58,124.97
A22  (via drill 0.5)
  Top 0.254: IC11.2 175.13,128.91 175.77,129.54 175.77,132.08 175.26,132.59 v149.35,132.59
  Top 0.305: v149.35,132.59 148.84,132.08 IC5.10 | v187.07,127.64 176.28,127.64 175.07,128.84 173.8,128.84 IC11.2
  Bottom 0.254: R45.1 175.9,128.02 175.01,128.91 IC11.2
  Bottom 0.305: IC4.51 156.46,194.31 154.43,192.28 154.43,180.09 151.64,177.29 151.64,134.87 v149.35,132.59 | IC12.6 199.39,14.61 198.12,15.88 198.12,25.91 190.88,33.15 180.09,33.15 178.18,35.05 178.18,75.44 177.29,76.33 177.29,90.42 188.72,101.85 188.72,125.98 v187.07,127.64
A23  (via drill 0.5)
  Top 0.254: IC11.1 149.73,131.44 v149.35,131.06
  Top 0.305: v149.35,131.06 141.22,131.06 IC5.11 | v189.36,129.41 188.59,130.18 v179.83,130.18
  Bottom 0.254: R44.1 IC11.1
  Bottom 0.305: IC4.52 167.89,196.85 168.66,196.09 168.66,194.06 167.89,193.29 156.72,193.29 155.19,191.77 155.19,179.83 152.4,177.04 152.4,134.11 v149.35,131.06 | IC12.7 201.93,14.61 200.66,15.88 200.66,25.27 192.15,33.78 180.34,33.78 178.82,35.31 178.82,75.69 177.93,76.58 177.93,90.04 189.36,101.47 v189.36,129.41 | v179.83,130.18 176.78,130.18 176.53,130.43 176.53,131.38 R44.1
ACSI10  (via drill 0.5)